# Altium project M_DOT_2_SOM_STM32G4.PrjPcb
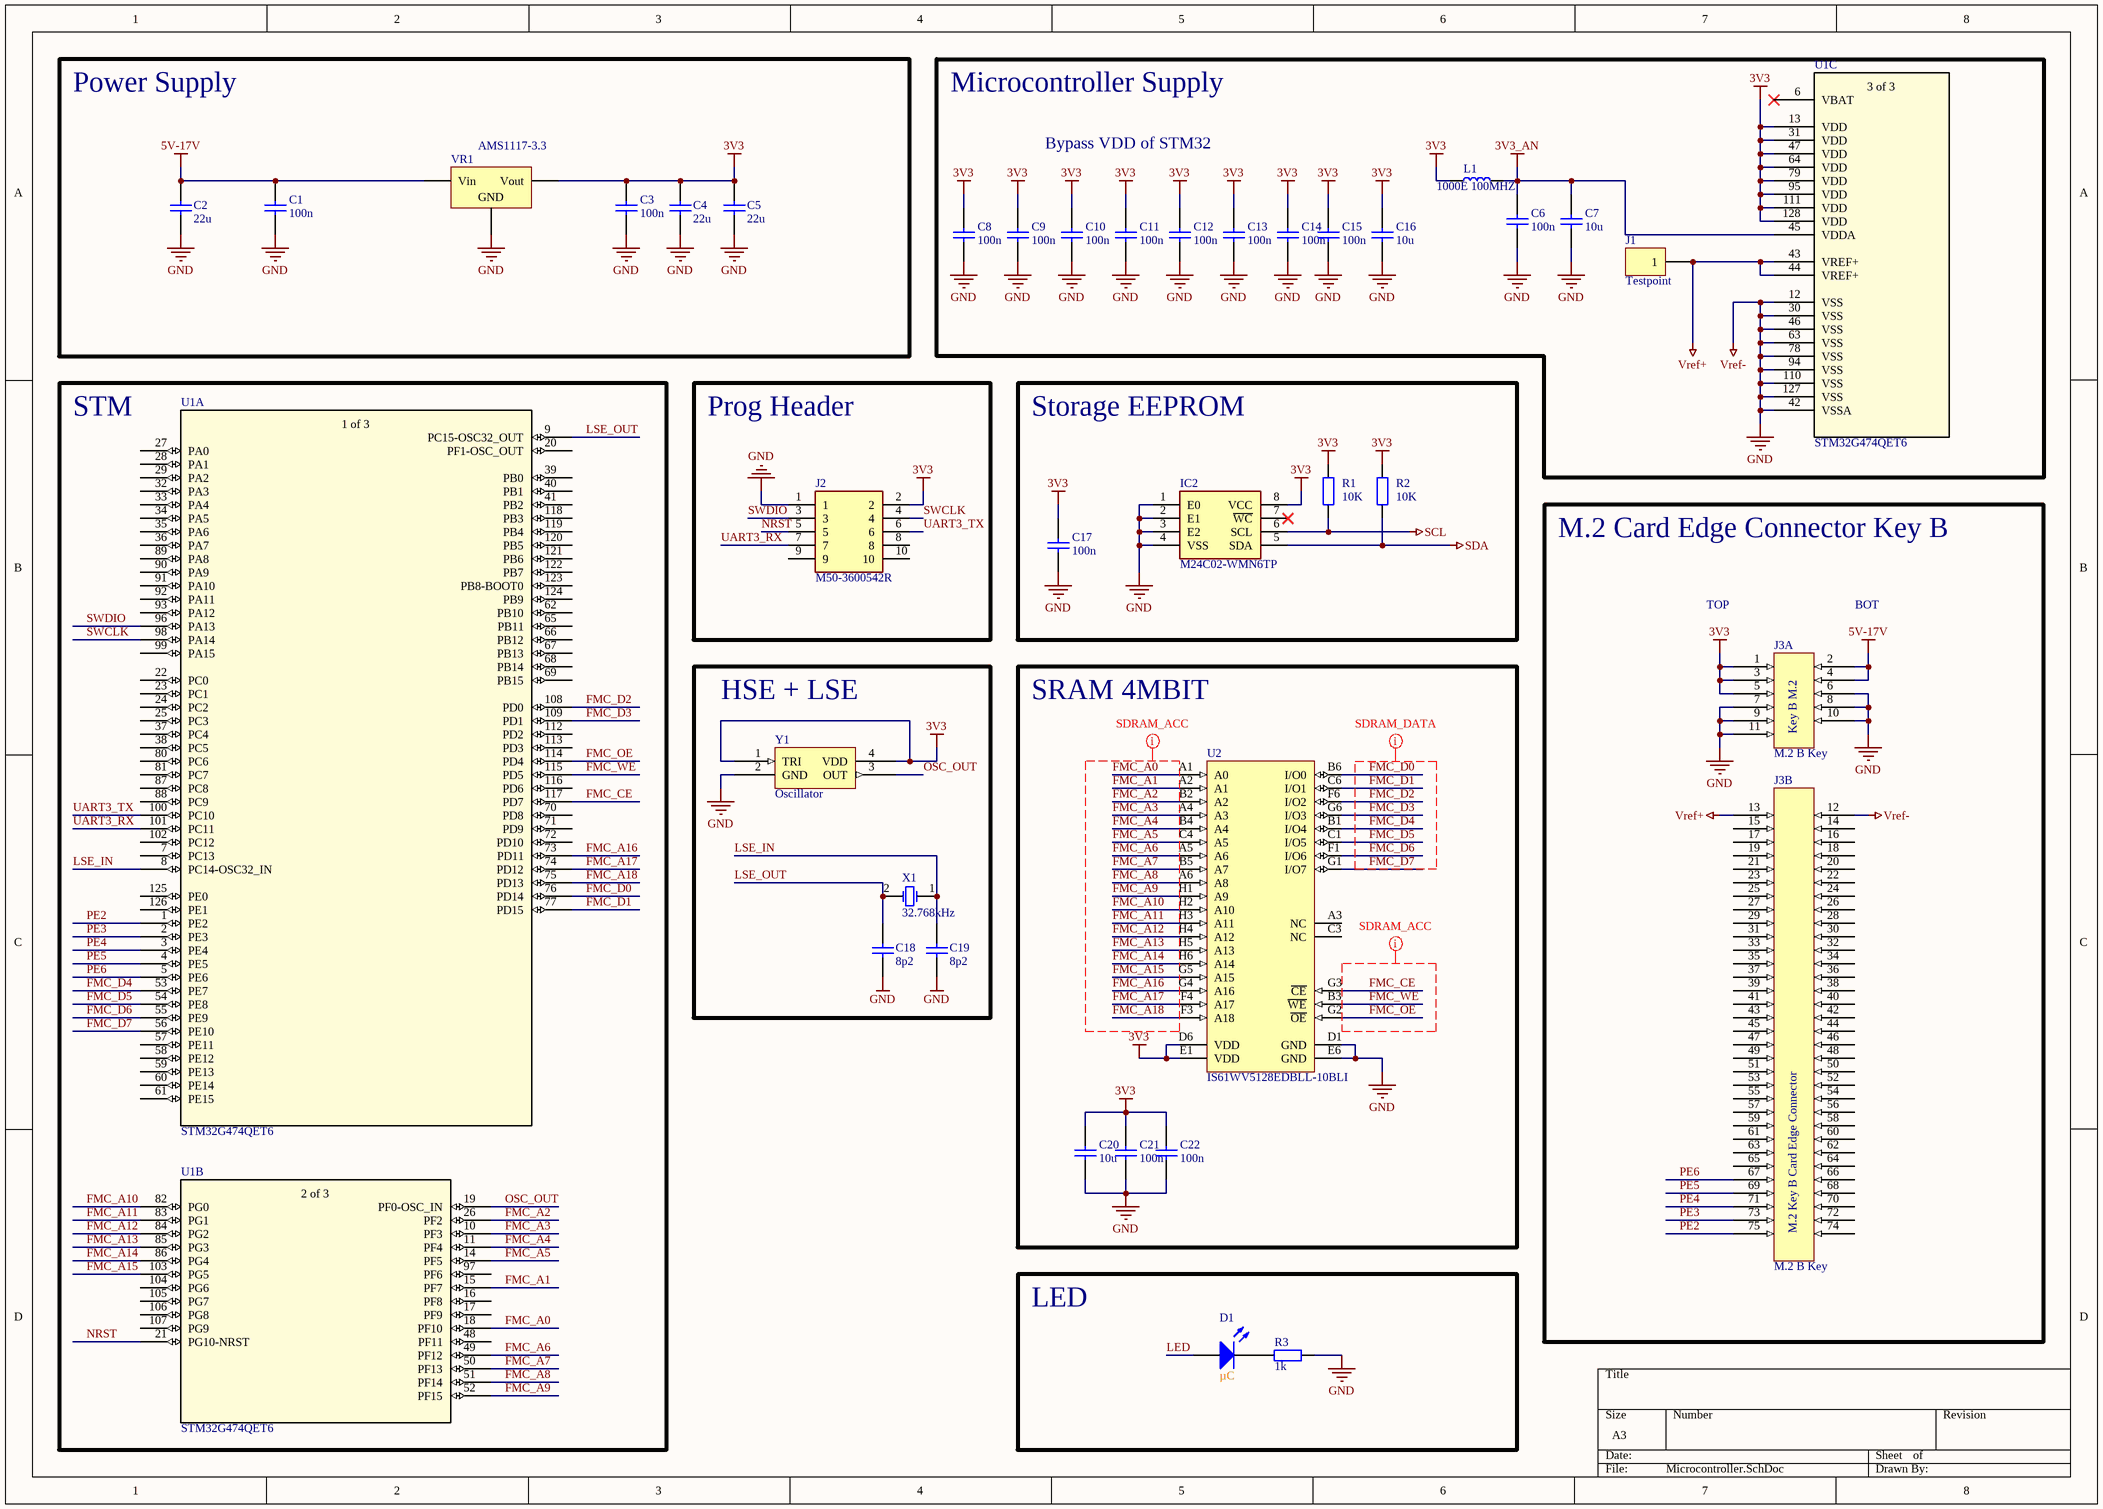
[diagram p0: Microcontroller.SchDoc]
1 sheet, 36 parts. Net scope: global (net labels, ports and power ports of the same name join across sheets).
Board file: M_DOT_2_SOM.PcbDoc

## Sheet Microcontroller.SchDoc
size A3

### Parts
C1  100n  [0402C]
C2  22u  [1206C]
C3  100n  [0402C]
C4  22u  [1206C]
C5  22u  [1206C]
C6  100n  [0402C]
C7  10u  [0603CH]
C8  100n  [0402C]
C9  100n  [0402C]
C10  100n  [0402C]
C11  100n  [0402C]
C12  100n  [0402C]
C13  100n  [0402C]
C14  100n  [0402C]
C15  100n  [0402C]
C16  10u  [0603CH]
C17  100n  [0402C]
C18  8p2  [0402C]
C19  8p2  [0402C]
C20  10u  [0603CH]
C21  100n  [0402C]
C22  100n  [0402C]
D1  µC  [1206_C]
IC2  M24C02-WMN6TP  [SOIC127P600X175-8N]
J1  Testpoint  [TESTPOINT]
J2  M50-3600542R  [HUSSP10W40P127_2X5_635X340X420P]
J3  M.2 B Key  [M.2 Key B]  (parts A,B of 2)
L1  1000E 100MHZ  [0603L]
R1  10K  [0402R]
R2  10K  [0402R]
R3  value 1k  [0402_R]  (hidden comment: Res2)
U1  STM32G474QET6  [LPQFP-128]  (parts A,B,C of 3)
U2  IS61WV5128EDBLL-10BLI  [ISSI-TF-BGA-36-6000x8000DE]
VR1  AMS1117-3.3  [SOT-223]
X1  32.768kHz  [XTAL32768]
Y1  Oscillator  [Crystal SMD3225]

### Blocks framed on the sheet
Power Supply: C1-C5 VR1
Microcontroller Supply: C6-C16 J1 L1 U1
STM: U1
Prog Header: J2
Storage EEPROM: C17 IC2 R1 R2
M.2 Card Edge Connector Key B: J3
HSE + LSE: C18 C19 X1 Y1
SRAM 4MBIT: C20-C22 U2
LED: D1 R3

### Nets
3V3: C3.2 C4.2 C5.2 C8.2 C9.2 C10.2 C11.2 C12.2 C13.2 C14.2 C15.2 C16.1 C17.2 C20.1 C21.2 C22.2 IC2.8(VCC) J2.2 J3.1 J3.3 J3.5 L1.1 R1.1 R2.1 U1.13(VDD) U1.31(VDD) U1.47(VDD) U1.64(VDD) U1.79(VDD) U1.95(VDD) U1.111(VDD) U1.128(VDD) U2.D6(VDD) U2.E1(VDD) VR1.2(Vout) Y1.1(TRI) Y1.4(VDD)
3V3_AN: C6.2 C7.1 L1.2 U1.45(VDDA)
5V-17V: C1.2 C2.2 J3.2 J3.4 VR1.3(Vin)
GND: C1.1 C2.1 C3.1 C4.1 C5.1 C6.1 C7.2 C8.1 C9.1 C10.1 C11.1 C12.1 C13.1 C14.1 C15.1 C16.2 C17.1 C18.1 C19.1 C20.2 C21.1 C22.1 IC2.1(E0) IC2.2(E1) IC2.3(E2) IC2.4(VSS) J2.1 J3.6 J3.7 J3.8 J3.9 J3.10 J3.11 J3.12 R3.1 U1.12(VSS) U1.30(VSS) U1.42(VSSA) U1.46(VSS) U1.63(VSS) U1.78(VSS) U1.94(VSS) U1.110(VSS) U1.127(VSS) U2.D1(GND) U2.E6(GND) VR1.1(GND) Y1.2(GND)  [also labelled Vref-]
SCL: IC2.6(SCL) R1.2
SDA: IC2.5(SDA) R2.2
Vref+: J1.1 J3.13 U1.43(VREF+) U1.44(VREF+)
FMC_A0: U1.18(PF10) U2.A1(A0)
FMC_A1: U1.15(PF7) U2.A2(A1)
FMC_A2: U1.26(PF2) U2.B2(A2)
FMC_A3: U1.10(PF3) U2.A4(A3)
FMC_A4: U1.11(PF4) U2.B4(A4)
FMC_A5: U1.14(PF5) U2.C4(A5)
FMC_A6: U1.49(PF12) U2.A5(A6)
FMC_A7: U1.50(PF13) U2.B5(A7)
FMC_A8: U1.51(PF14) U2.A6(A8)
FMC_A9: U1.52(PF15) U2.H1(A9)
FMC_A10: U1.82(PG0) U2.H2(A10)
FMC_A11: U1.83(PG1) U2.H3(A11)
FMC_A12: U1.84(PG2) U2.H4(A12)
FMC_A13: U1.85(PG3) U2.H5(A13)
FMC_A14: U1.86(PG4) U2.H6(A14)
FMC_A15: U1.103(PG5) U2.G5(A15)
FMC_A16: U1.73(PD11) U2.G4(A16)
FMC_A17: U1.74(PD12) U2.F4(A17)
FMC_A18: U1.75(PD13) U2.F3(A18)
FMC_CE: U1.117(PD7) U2.G3(~{CE})
FMC_D0: U1.76(PD14) U2.B6(I/O0)
FMC_D1: U1.77(PD15) U2.C6(I/O1)
FMC_D2: U1.108(PD0) U2.F6(I/O2)
FMC_D3: U1.109(PD1) U2.G6(I/O3)
FMC_D4: U1.53(PE7) U2.B1(I/O4)
FMC_D5: U1.54(PE8) U2.C1(I/O5)
FMC_D6: U1.55(PE9) U2.F1(I/O6)
FMC_D7: U1.56(PE10) U2.G1(I/O7)
FMC_OE: U1.114(PD4) U2.G2(~{OE})
FMC_WE: U1.115(PD5) U2.B3(~{WE})
LED: D1.1(A)
LSE_IN: C19.2 U1.8(PC14-OSC32_IN) X1.1(OSC1)
LSE_OUT: C18.2 U1.9(PC15-OSC32_OUT) X1.2(OSC2)
NRST: J2.5 U1.21(PG10-NRST)
OSC_OUT: U1.19(PF0-OSC_IN) Y1.3(OUT)
PE2: J3.75 U1.1(PE2)
PE3: J3.73 U1.2(PE3)
PE4: J3.71 U1.3(PE4)
PE5: J3.69 U1.4(PE5)
PE6: J3.67 U1.5(PE6)
SWCLK: J2.4 U1.98(PA14)
SWDIO: J2.3 U1.96(PA13)
UART3_RX: J2.7 U1.101(PC11)
UART3_TX: J2.6 U1.100(PC10)
NetD1_2: D1.2(K) R3.2

Not connected (* = marked no-connect by the designer): IC2 7(~{WC})*; J2 8 9 10; J3 14 15 16 17 18 19 20 21 22 23 24 25 26 27 28 29 30 31 32 33 34 35 36 37 38 39 40 41 42 43 44 45 46 47 48 49 50 51 52 53 54 55 56 57 58 59 60 61 62 63 64 65 66 68 70 72 74; U1 6(VBAT)* 7(PC13) 16(PF8) 17(PF9) 20(PF1-OSC_OUT) 22(PC0) 23(PC1) 24(PC2) 25(PC3) 27(PA0) 28(PA1) 29(PA2) 32(PA3) 33(PA4) 34(PA5) 35(PA6) 36(PA7) 37(PC4) 38(PC5) 39(PB0) 40(PB1) 41(PB2) 48(PF11) 57(PE11) 58(PE12) 59(PE13) 60(PE14) 61(PE15) 62(PB10) 65(PB11) 66(PB12) 67(PB13) 68(PB14) 69(PB15) 70(PD8) 71(PD9) 72(PD10) 80(PC6) 81(PC7) 87(PC8) 88(PC9) 89(PA8) 90(PA9) 91(PA10) 92(PA11) 93(PA12) 97(PF6) 99(PA15) 102(PC12) 104(PG6) 105(PG7) 106(PG8) 107(PG9) 112(PD2) 113(PD3) 116(PD6) 118(PB3) 119(PB4) 120(PB5) 121(PB6) 122(PB7) 123(PB8-BOOT0) 124(PB9) 125(PE0) 126(PE1); U2 A3(NC) C3(NC)

### Layout directives
net class SDRAM_ACC: FMC_A0, FMC_A1, FMC_A2, FMC_A3, FMC_A4, FMC_A5, FMC_A6, FMC_A7, FMC_A8, FMC_A9, FMC_A10, FMC_A11, FMC_A12, FMC_A13, FMC_A14, FMC_A15, FMC_A16, FMC_A17, FMC_A18, FMC_CE, FMC_OE, FMC_WE
net class SDRAM_DATA: FMC_D0, FMC_D1, FMC_D2, FMC_D3, FMC_D4, FMC_D5, FMC_D6, FMC_D7

### Notes on the sheet
- Bypass VDD of STM32
- TOP
- BOT
- (in symbol M.2 B Key, part A) Key B M.2
- (in symbol M.2 B Key, part B) M.2 Key B Card Edge Connector
- (in symbol STM32G474QET6, part A) 1 of 3
- (in symbol STM32G474QET6, part B) 2 of 3
- (in symbol STM32G474QET6, part C) 3 of 3

### Library data of the parts
C1-C22 = Cap Ceramic: Kondensator
D1 = LED2: Typical RED, GREEN, YELLOW, AMBER GaAs LED; Published: 8-Jun-2000; LatestRevisionDate: 17-Jul-2002; LatestRevisionNote: Re-released for DXP Platform.; PackageVersion: Feb-2002; PackageReference: 3.2X1.6X1.1; Publisher: Altium Limited; PackageDescription: SM LED; 2 Flat Leads
IC2 = M24C02-WMN6TP: Integrated Circuit; Manufacturer_Name: STMicroelectronics; Datasheet Link: http://www.st.com/st-web-ui/static/active/en/resource/technical/document/datasheet/DM00071904.pdf; Height: 1.75mm; Manufacturer_Part_Number: M24C02-WMN6TP; Mouser Part Number: 511-M24C02-WMN6TP; Mouser Price/Stock: https://www.mouser.co.uk/ProductDetail/STMicroelectronics/M24C02-WMN6TP?qs=%252B9pWl1iD4MV6%252BhhMP%2F%252BxlQ%3D%3D; Arrow Part Number: M24C02-WMN6TP; Arrow Price/Stock: https://www.arrow.com/en/products/m24c02-wmn6tp/stmicroelectronics
J1 = Header 1: Header, 1-Pin; LatestRevisionDate: 17-Jul-2002; LatestRevisionNote: Re-released for DXP Platform.; Publisher: Altium Limited
J2 = M50-3600542R: Connector; Manufacturer_Name: Harwin; Datasheet Link: https://cdn.harwin.com/pdfs/M50-360R.pdf; Manufacturer_Part_Number: M50-3600542R; Mouser Part Number: 855-M50-3600542R; Mouser Price/Stock: https://www.mouser.co.uk/ProductDetail/Harwin/M50-3600542R?qs=DVxm2sPGGrrPu%2FxuhpV3yw%3D%3D
L1 = Inductor
R1 R2 = Resistor: Widerstand
R3 = Res2: Resistor; Published: 8-Jun-2000; LatestRevisionDate: 17-Jul-2002; LatestRevisionNote: Re-released for DXP Platform.; PackageReference: AXIAL-0.4; Publisher: Altium Limited; PackageDescription: Axial Device, Thru-Hole; 2 Leads; 0.4 in Pin Spacing
U1 = STM32G474QET6: No Description Available; Mfr_Name: STMicroelectronics; RefDes: RefDes; Type: Type
U2 = CMP-0513-00078-1: 4 M High Speed Asynchronous CMOS SRAM with ECC, 512 K x 8, -40 to 85 degC, 36-Pin BGA (TF-BGA-36), Pb-Free; Manufacturer: Integrated Silicon Solution Inc (ISSI); Packing: Tray / Tube; Speed (ns): 10; Organization: 512K x 8; Density: 4M; PackageDescription: 36-Pin 6 x 8 mm TF-BGA, Pitch 0.75 mm; DatasheetVersion: Rev. F; PartNumber: IS61WV5128EDBLL-10BLI; ComponentLink2Description: Datasheet; PackageReference: TF-BGA-36; ComponentLink1URL: http://www.issi.com/US/index.shtml; Mounting Technology: Surface Mount; ComponentLink3Description: Package Specification; RoHS: Pb-Free; ComponentLink2URL: http://www.issi.com/WW/pdf/61-64WV5128EDBLL.pdf; ComponentLink1Description: Manufacturer URL; Code_JEDEC: MO-207; PackageVersion: Rev. E, 08/2008; ComponentLink3URL: http://www.issi.com/WW/pdf/62-65WV2568DALL_BLL.pdf
VR1 = SOT-223 AMS1117-3.3: 低压差线性稳压(LDO); ComponentLink1Description: 供应商链接; ComponentLink1URL: http://www.szlcsc.com/product/details_6652.html; Package: SOT-223; Supplier: LC; SuppliersPartNumber: C6186
X1 = XTAL: Crystal Oscillator; Published: 8-Jun-2000; LatestRevisionDate: 17-Jul-2002; LatestRevisionNote: Re-released for DXP Platform.; PackageReference: R38; Publisher: Altium Limited